# EAGLE design CartePrincipale (EAGLE 6.3)
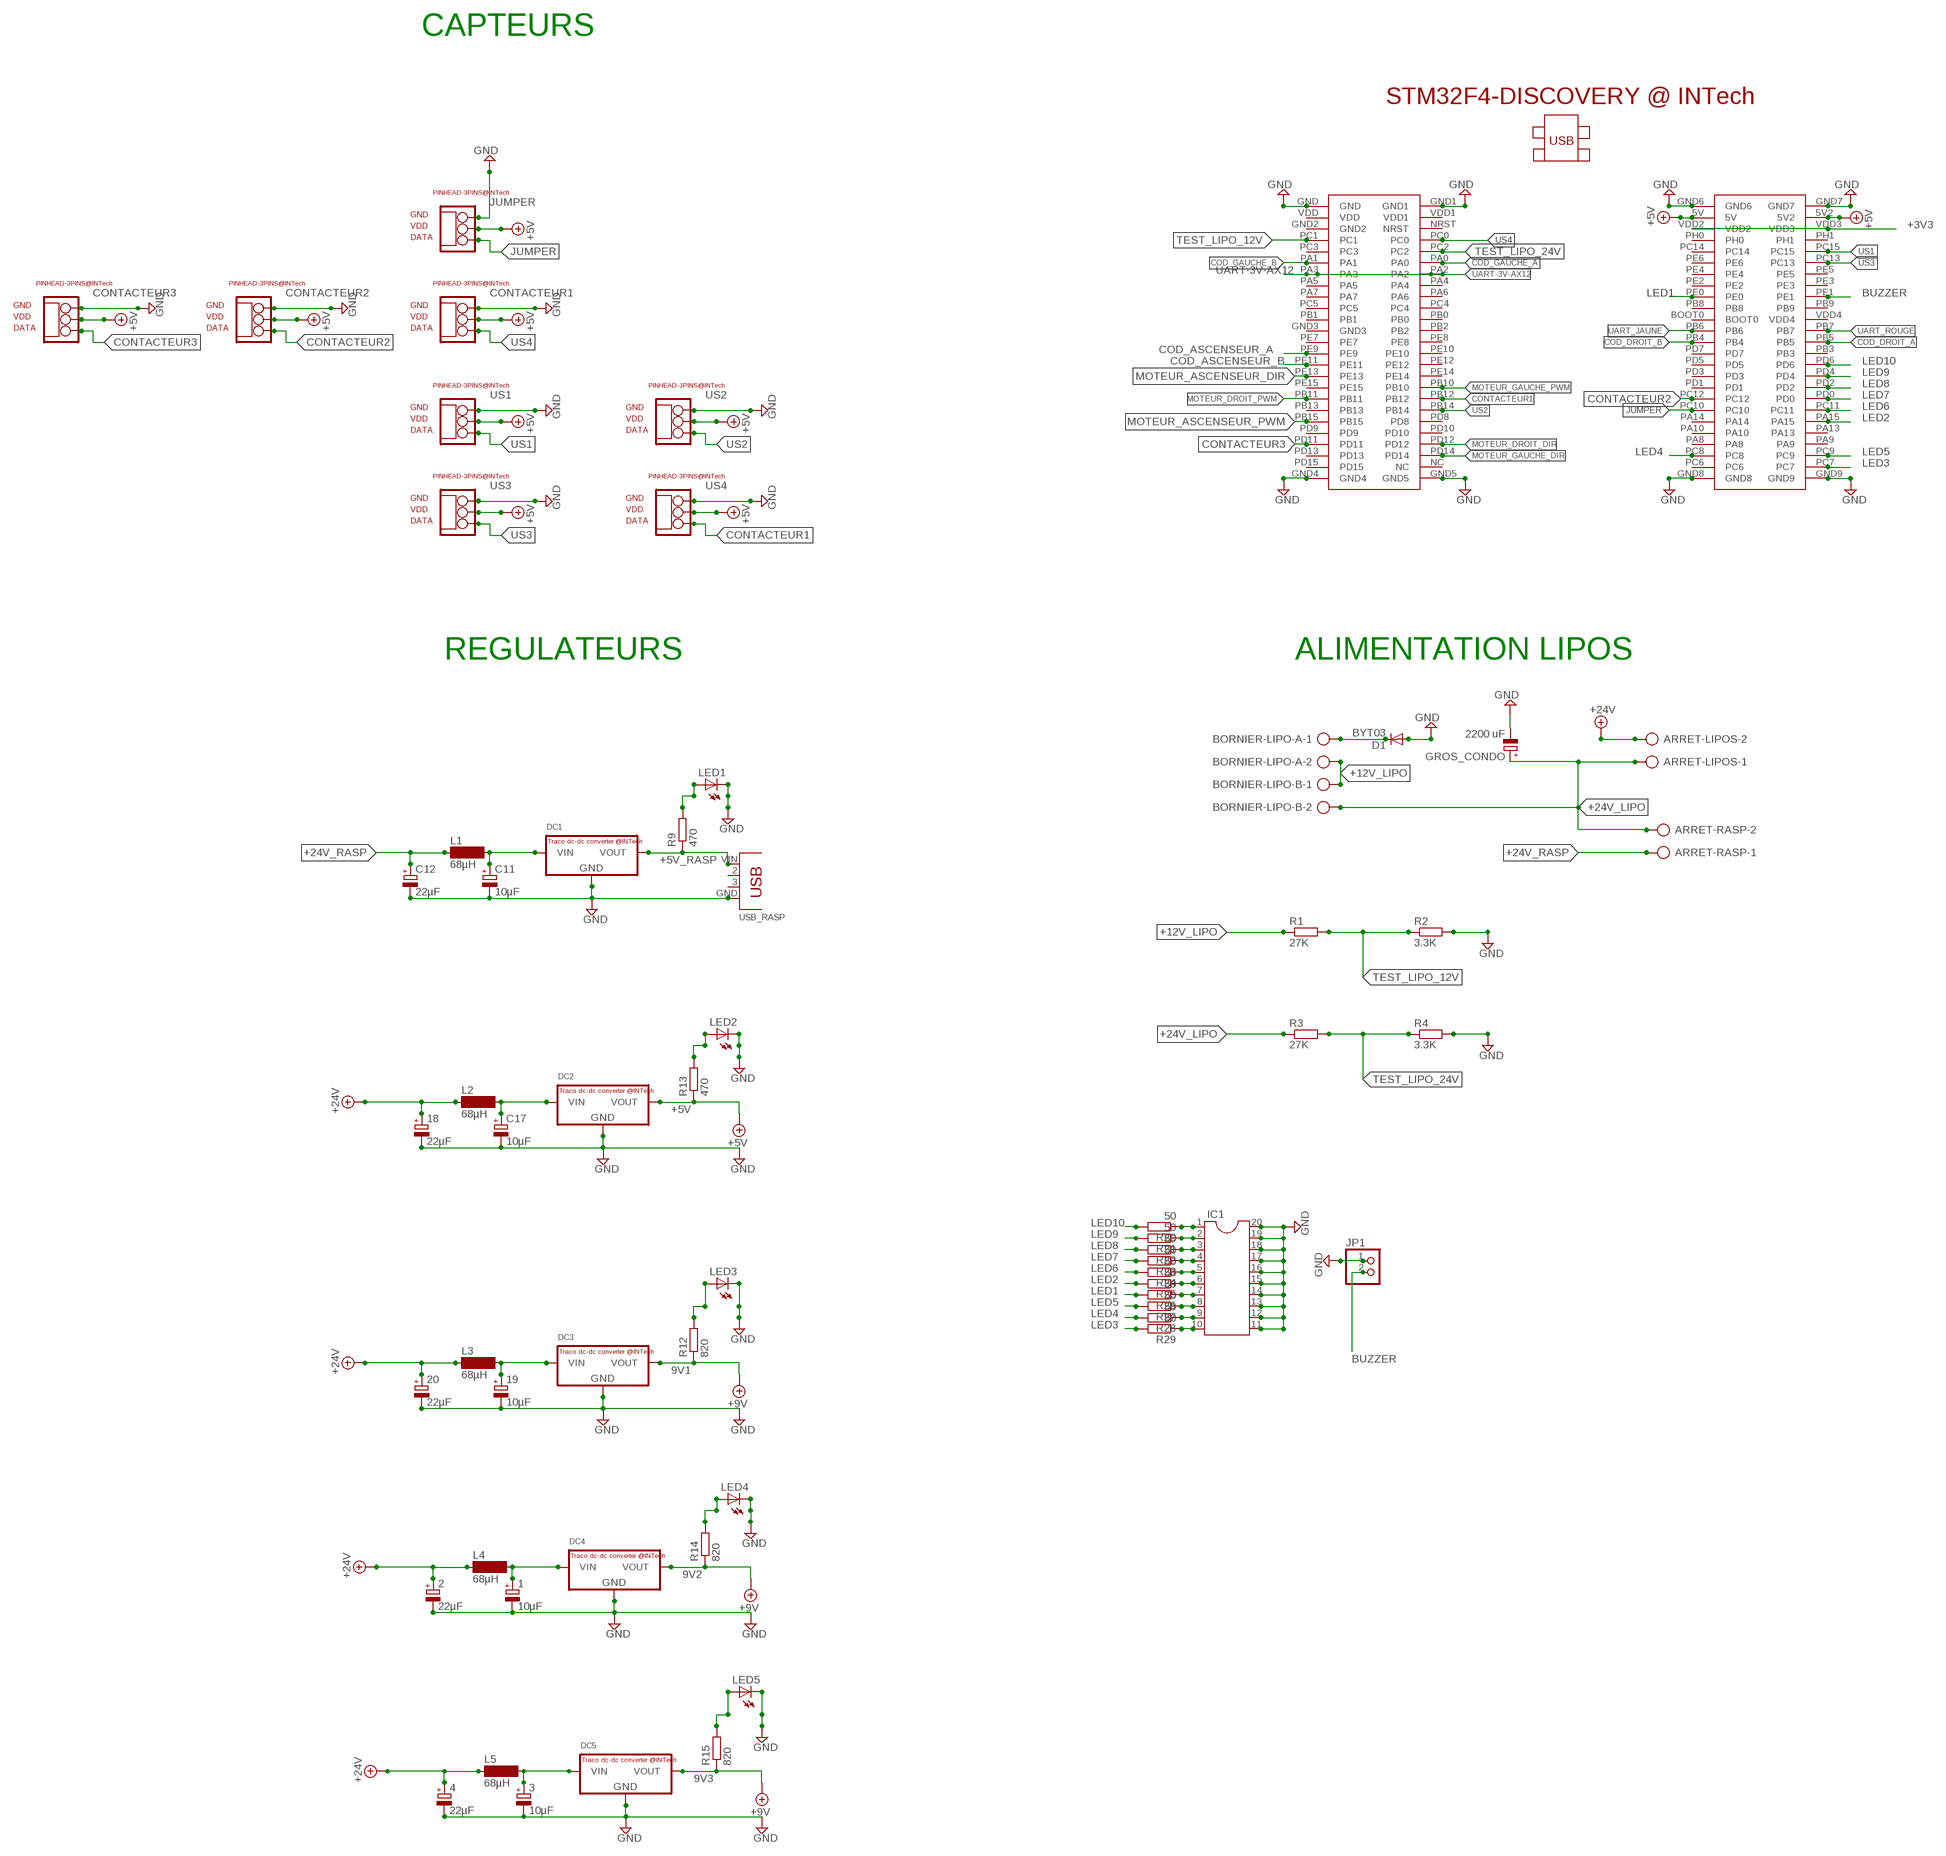
[diagram p0: schematic, sheet 1, part 1 of 2]
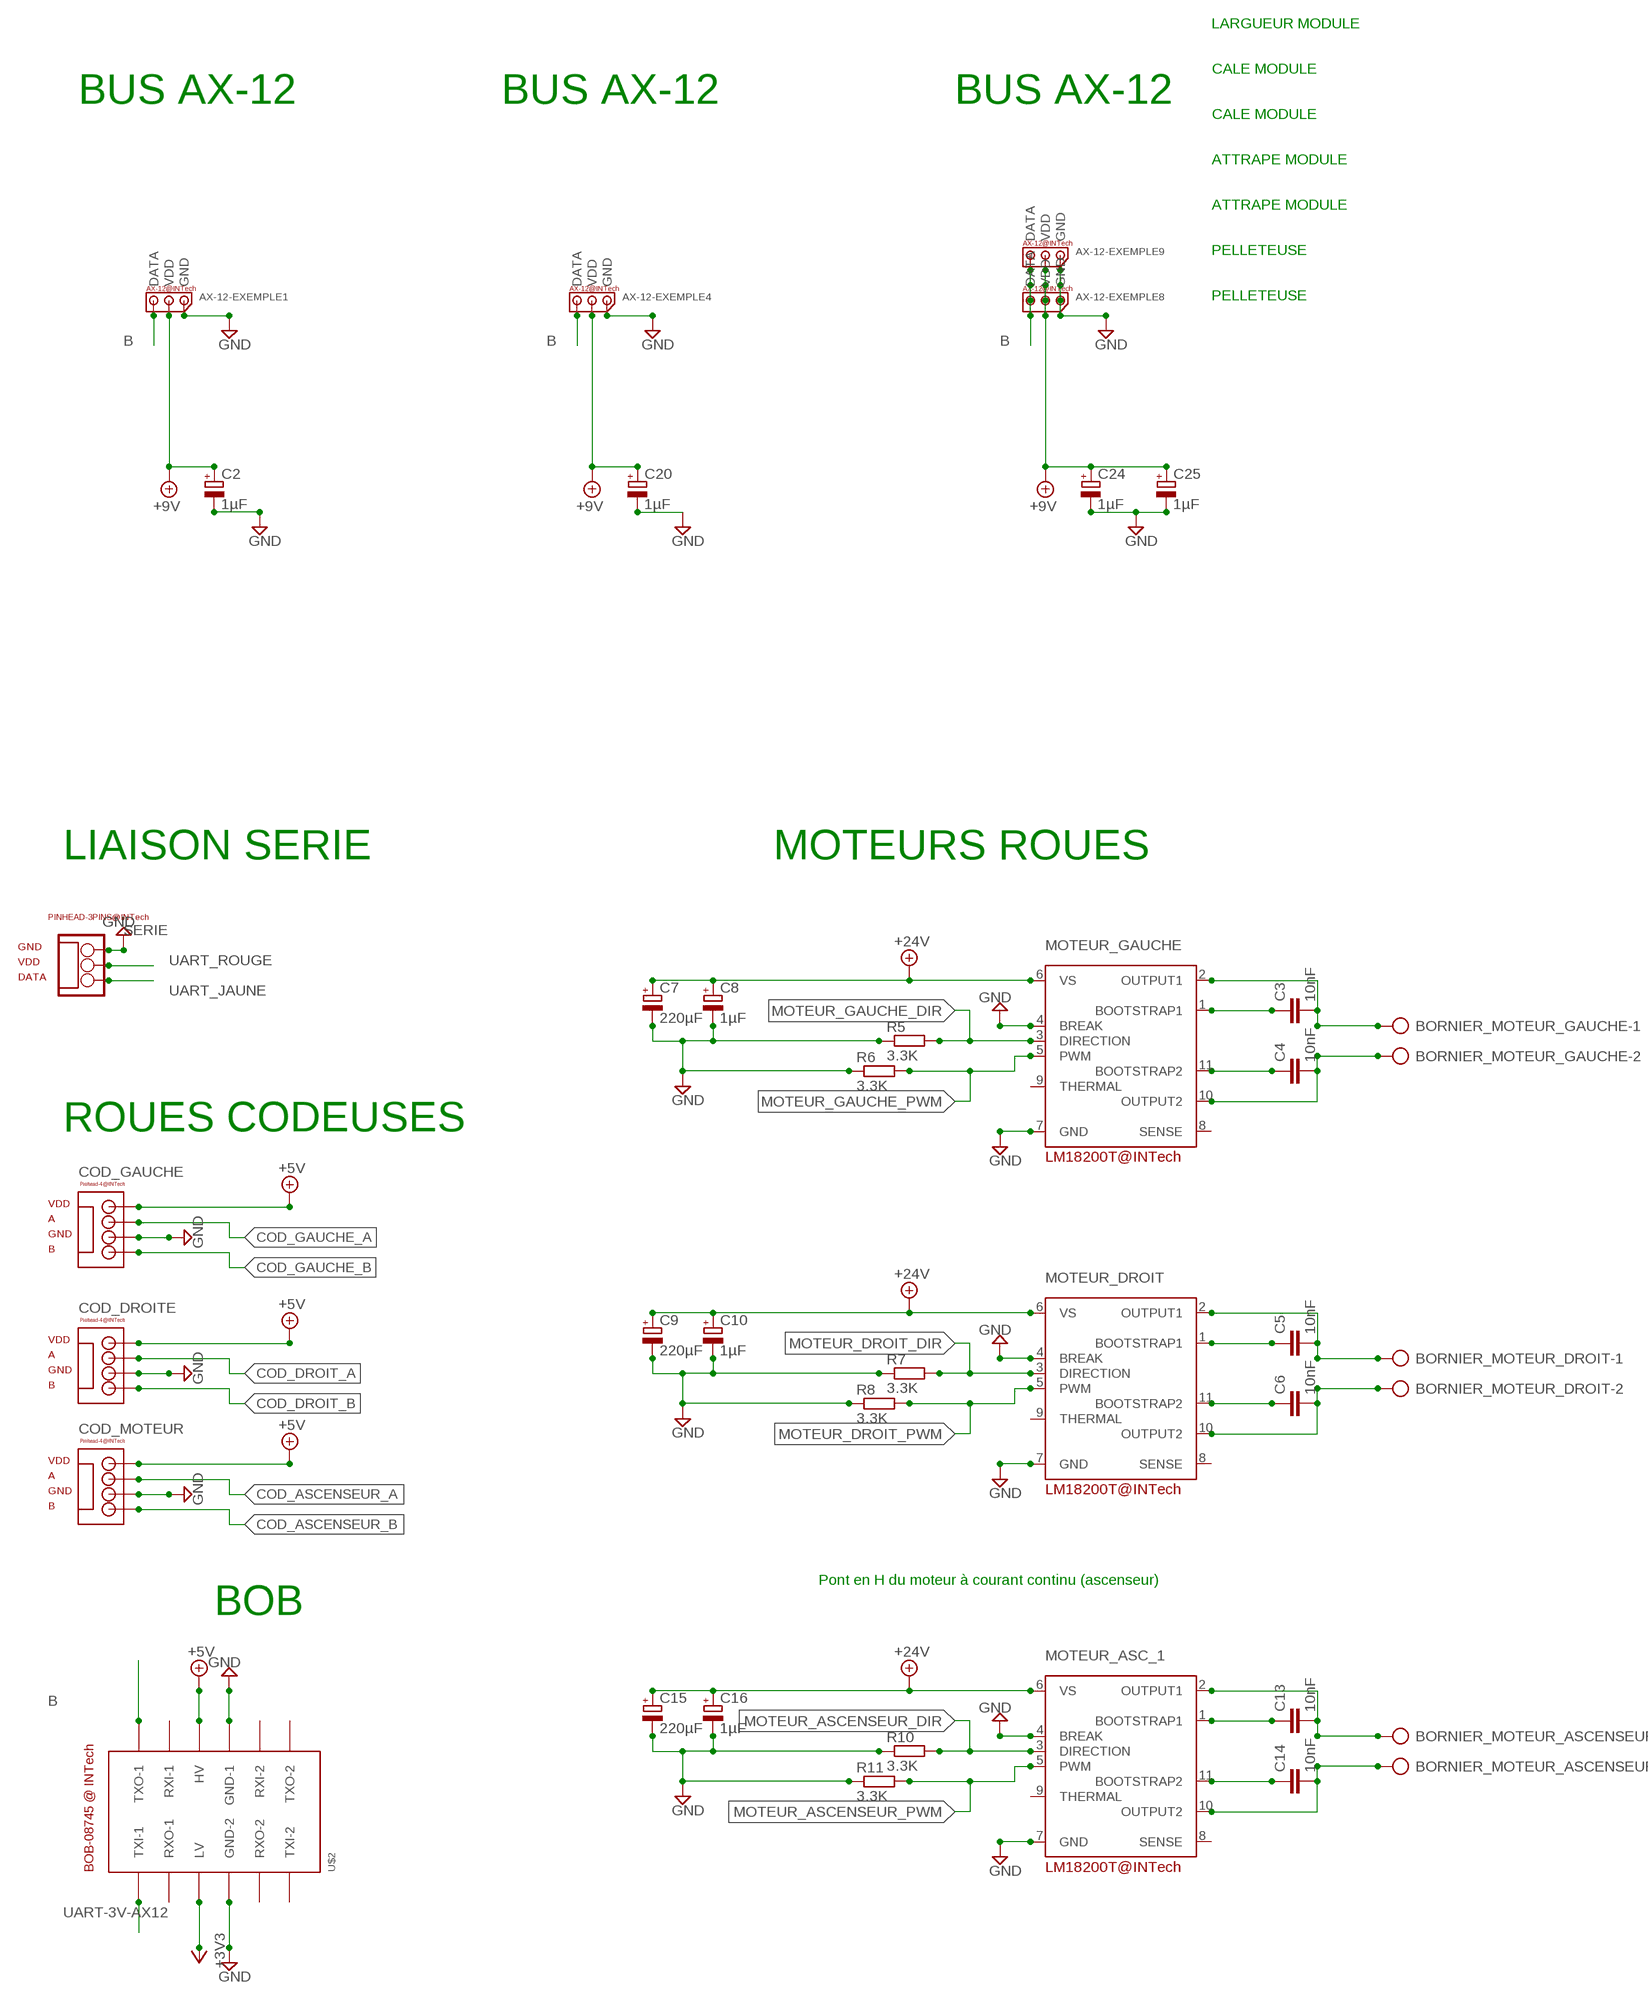
[diagram p1: schematic, sheet 1, part 2 of 2]

## Parts
1  10µF  CPOL-EUE2.5-6  [E2,5-6]
2  22µF  CPOL-EUE2.5-6  [E2,5-6]
3  10µF  CPOL-EUE2.5-6  [E2,5-6]
4  22µF  CPOL-EUE2.5-6  [E2,5-6]
18  22µF  CPOL-EUE2.5-6  [E2,5-6]
19  10µF  CPOL-EUE2.5-6  [E2,5-6]
20  22µF  CPOL-EUE2.5-6  [E2,5-6]
ARRET-LIPOS  AK300/2  [AK300/2]
ARRET-RASP  AK300/2  [AK300/2]
AX-12-EXEMPLE1  AX-12_CF_INTECH  [AX-12_CF_INTECH]
AX-12-EXEMPLE4  AX-12_CF_INTECH  [AX-12_CF_INTECH]
AX-12-EXEMPLE8  AX-12_CF_INTECH  [AX-12_CF_INTECH]
AX-12-EXEMPLE9  AX-12_CF_INTECH  [AX-12_CF_INTECH]
BORNIER-LIPO-A  AK300/2  [AK300/2]
BORNIER-LIPO-B  AK300/2  [AK300/2]
BORNIER_MOTEUR_ASCENSEUR  AK300/2  [AK300/2]
BORNIER_MOTEUR_DROIT  AK300/2  [AK300/2]
BORNIER_MOTEUR_GAUCHE  AK300/2  [AK300/2]
C2  1µF  CPOL-EUE2,5-6E  [E2,5-6E]
C3  10nF  C-EU050-025X075  [C050-025X075]
C4  10nF  C-EU050-025X075  [C050-025X075]
C5  10nF  C-EU050-025X075  [C050-025X075]
C6  10nF  C-EU050-025X075  [C050-025X075]
C7  220µF  CPOL-EUE3.5-8  [E3,5-8]
C8  1µF  CPOL-EUE3.5-8  [E3,5-8]
C9  220µF  CPOL-EUE3.5-8  [E3,5-8]
C10  1µF  CPOL-EUE3.5-8  [E3,5-8]
C11  10µF  CPOL-EUE2.5-6  [E2,5-6]
C12  22µF  CPOL-EUE2.5-6  [E2,5-6]
C13  10nF  C-EU050-025X075  [C050-025X075]
C14  10nF  C-EU050-025X075  [C050-025X075]
C15  220µF  CPOL-EUE3.5-8  [E3,5-8]
C16  1µF  CPOL-EUE3.5-8  [E3,5-8]
C17  10µF  CPOL-EUE2.5-6  [E2,5-6]
C20  1µF  CPOL-EUE2,5-6E  [E2,5-6E]
C24  1µF  CPOL-EUE2,5-6E  [E2,5-6E]
C25  1µF  CPOL-EUE2,5-6E  [E2,5-6E]
COD_DROITE  PINHEAD-4_CF_INTECH  [PINHEAD-4_CF_INTECH]
COD_GAUCHE  PINHEAD-4_CF_INTECH  [PINHEAD-4_CF_INTECH]
COD_MOTEUR  PINHEAD-4_CF_INTECH  [PINHEAD-4_CF_INTECH]
CONTACTEUR1  PINHEAD_CF_INTECH  [PINHEAD_CF_INTECH]
CONTACTEUR2  PINHEAD_CF_INTECH  [PINHEAD_CF_INTECH]
CONTACTEUR3  PINHEAD_CF_INTECH  [PINHEAD_CF_INTECH]
D1  BYT03  [DO27-15]
DC1  5V_1A  R-78C-1.0_INTECH  [SIP3_INTECH]
DC2  5V_1A  R-78C-1.0_INTECH  [SIP3_INTECH]
DC3  9V_1A  R-78C-1.0_INTECH  [SIP3_INTECH]
DC4  9V_1A  R-78C-1.0_INTECH  [SIP3_INTECH]
DC5  9V_1A  R-78C-1.0_INTECH  [SIP3_INTECH]
GROS_CONDO  2200 uF  CPOL-EUE10-20  [EB20D]
IC1  DIL20S  [SOCKET-20]
JP1  PINHD-1X2  [1X02]
JUMPER  PINHEAD_CF_INTECH  [PINHEAD_CF_INTECH]
L1  68µH  SD12K100  [SD12K100]
L2  68µH  SD12K100  [SD12K100]
L3  68µH  SD12K100  [SD12K100]
L4  68µH  SD12K100  [SD12K100]
L5  68µH  SD12K100  [SD12K100]
LED1  LED5MM  [LED5MM]
LED2  LED5MM  [LED5MM]
LED3  LED5MM  [LED5MM]
LED4  LED5MM  [LED5MM]
LED5  LED5MM  [LED5MM]
MOTEUR_ASC_1  LM18200T_CF_INTECH  [LM18200T_CF_INTECH]
MOTEUR_DROIT  LM18200T_CF_INTECH  [LM18200T_CF_INTECH]
MOTEUR_GAUCHE  LM18200T_CF_INTECH  [LM18200T_CF_INTECH]
R1  27K  R-EU_0207/10  [0207/10]
R2  3.3K  R-EU_0207/10  [0207/10]
R3  27K  R-EU_0207/10  [0207/10]
R4  3.3K  R-EU_0207/10  [0207/10]
R5  3.3K  R-EU_0207/10  [0207/10]
R6  3.3K  R-EU_0207/10  [0207/10]
R7  3.3K  R-EU_0207/10  [0207/10]
R8  3.3K  R-EU_0207/10  [0207/10]
R9  470  R-EU_0207/10  [0207/10]
R10  3.3K  R-EU_0207/10  [0207/10]
R11  3.3K  R-EU_0207/10  [0207/10]
R12  820  R-EU_0207/10  [0207/10]
R13  470  R-EU_0207/10  [0207/10]
R14  820  R-EU_0207/10  [0207/10]
R15  820  R-EU_0207/10  [0207/10]
R20  50  R-EU_0207/2V  [0207/2V]
R21  50  R-EU_0207/2V  [0207/2V]
R22  50  R-EU_0207/2V  [0207/2V]
R23  50  R-EU_0207/2V  [0207/2V]
R24  50  R-EU_0207/2V  [0207/2V]
R25  50  R-EU_0207/2V  [0207/2V]
R26  50  R-EU_0207/2V  [0207/2V]
R27  50  R-EU_0207/2V  [0207/2V]
R28  50  R-EU_0207/2V  [0207/2V]
R29  50  R-EU_0207/2V  [0207/2V]
SERIE  PINHEAD_CF_INTECH  [PINHEAD_CF_INTECH]
U$1  STM32F4-DISCOVERY  [STM32F4-DISCOVERY]
U$2  BOB-08745  [BOB-08745]
US1  PINHEAD_CF_INTECH  [PINHEAD_CF_INTECH]
US2  PINHEAD_CF_INTECH  [PINHEAD_CF_INTECH]
US3  PINHEAD_CF_INTECH  [PINHEAD_CF_INTECH]
US4  PINHEAD_CF_INTECH  [PINHEAD_CF_INTECH]
USB_RASP  USB_87520  [USB]

## Nets
9V1: AX-12-EXEMPLE8.VDD AX-12-EXEMPLE9.VDD C24.+ C25.+ DC3.VOUT R12.1 ; supply symbol labelled +9V
9V2: AX-12-EXEMPLE4.VDD C20.+ DC4.VOUT R14.1 ; supply symbol labelled +9V
9V3: AX-12-EXEMPLE1.VDD C2.+ DC5.VOUT R15.1 ; supply symbol labelled +9V
+3V3: U$1.VDD2 U$1.VDD3 U$2.LV
+5V: COD_DROITE.VDD COD_GAUCHE.VDD COD_MOTEUR.VDD CONTACTEUR1.VDD CONTACTEUR2.VDD CONTACTEUR3.VDD DC2.VOUT JUMPER.VDD R13.1 U$1.5V U$1.5V2 U$2.HV US1.VDD US2.VDD US3.VDD US4.VDD
+5V_RASP: DC1.VOUT R9.1 USB_RASP.VIN
+12V_LIPO: BORNIER-LIPO-A.2 BORNIER-LIPO-B.1 R1.1
+24V: 2.+ 4.+ 18.+ 20.+ ARRET-LIPOS.2 C7.+ C8.+ C9.+ C10.+ C15.+ C16.+ L2.1 L3.1 L4.1 L5.1 MOTEUR_ASC_1.6(VS) MOTEUR_DROIT.6(VS) MOTEUR_GAUCHE.6(VS)
+24V_LIPO: ARRET-LIPOS.1 ARRET-RASP.2 BORNIER-LIPO-B.2 GROS_CONDO.+ R3.1
+24V_RASP: ARRET-RASP.1 C12.+ L1.1
B: AX-12-EXEMPLE1.DATA AX-12-EXEMPLE4.DATA AX-12-EXEMPLE8.DATA AX-12-EXEMPLE9.DATA U$2.TXO-1
BUZZER: JP1.2 U$1.PE1
COD_ASCENSEUR_A: COD_MOTEUR.A U$1.PE9
COD_ASCENSEUR_B: COD_MOTEUR.B U$1.PE11
COD_DROIT_A: COD_DROITE.A U$1.PB5
COD_DROIT_B: COD_DROITE.B U$1.PB4
COD_GAUCHE_A: COD_GAUCHE.A U$1.PA0
COD_GAUCHE_B: COD_GAUCHE.B U$1.PA1
CONTACTEUR1: U$1.PB12 US4.DATA
CONTACTEUR2: CONTACTEUR2.DATA U$1.PC12
CONTACTEUR3: CONTACTEUR3.DATA U$1.PD11
GND: 1.- 2.- 3.- 4.- 18.- 19.- 20.- AX-12-EXEMPLE1.GND AX-12-EXEMPLE4.GND AX-12-EXEMPLE8.GND AX-12-EXEMPLE9.GND C2.- C7.- C8.- C9.- C10.- C11.- C12.- C15.- C16.- C17.- C20.- C24.- C25.- COD_DROITE.GND COD_GAUCHE.GND COD_MOTEUR.GND CONTACTEUR1.GND CONTACTEUR2.GND CONTACTEUR3.GND D1.A DC1.GND DC2.GND DC3.GND DC4.GND DC5.GND GROS_CONDO.- IC1.11 IC1.12 IC1.13 IC1.14 IC1.15 IC1.16 IC1.17 IC1.18 IC1.19 IC1.20 JP1.1 JUMPER.GND LED1.K(C) LED2.K(C) LED3.K(C) LED4.K(C) LED5.K(C) MOTEUR_ASC_1.4(BREAK) MOTEUR_ASC_1.7(GND) MOTEUR_DROIT.4(BREAK) MOTEUR_DROIT.7(GND) MOTEUR_GAUCHE.4(BREAK) MOTEUR_GAUCHE.7(GND) R2.2 R4.2 R5.1 R6.1 R7.1 R8.1 R10.1 R11.1 SERIE.GND U$1.GND U$1.GND1 U$1.GND4 U$1.GND5 U$1.GND6 U$1.GND7 U$1.GND8 U$1.GND9 U$2.GND-1 U$2.GND-2 US1.GND US2.GND US3.GND US4.GND USB_RASP.GND
JUMPER: JUMPER.DATA U$1.PC10
LED1: R26.2 U$1.PE0
LED2: R25.2 U$1.PA15
LED3: R29.2 U$1.PC7
LED4: R28.2 U$1.PC8
LED5: R27.2 U$1.PC9
LED6: R24.2 U$1.PC11
LED7: R23.2 U$1.PD0
LED8: R22.2 U$1.PD2
LED9: R21.2 U$1.PD4
LED10: R20.2 U$1.PD6
MOTEUR_ASCENSEUR_DIR: MOTEUR_ASC_1.3(DIRECTION) R10.2 U$1.PE13
MOTEUR_ASCENSEUR_PWM: MOTEUR_ASC_1.5(PWM) R11.2 U$1.PB15
MOTEUR_DROIT_DIR: MOTEUR_DROIT.3(DIRECTION) R7.2 U$1.PD12
MOTEUR_DROIT_PWM: MOTEUR_DROIT.5(PWM) R8.2 U$1.PB11
MOTEUR_GAUCHE_DIR: MOTEUR_GAUCHE.3(DIRECTION) R5.2 U$1.PD14
MOTEUR_GAUCHE_PWM: MOTEUR_GAUCHE.5(PWM) R6.2 U$1.PB10
N$1: BORNIER-LIPO-A.1 D1.C
N$2: C4.1 MOTEUR_GAUCHE.11(BOOTSTRAP2)
N$3: C3.1 MOTEUR_GAUCHE.1(BOOTSTRAP1)
N$4: C13.1 MOTEUR_ASC_1.1(BOOTSTRAP1)
N$5: C14.1 MOTEUR_ASC_1.11(BOOTSTRAP2)
N$6: BORNIER_MOTEUR_ASCENSEUR.1 C13.2 MOTEUR_ASC_1.2(OUTPUT1)
N$7: BORNIER_MOTEUR_ASCENSEUR.2 C14.2 MOTEUR_ASC_1.10(OUTPUT2)
N$8: 1.+ DC4.VIN L4.2
N$9: LED1.A R9.2
N$10: C5.1 MOTEUR_DROIT.1(BOOTSTRAP1)
N$11: C6.1 MOTEUR_DROIT.11(BOOTSTRAP2)
N$12: C11.+ DC1.VIN L1.2
N$15: C17.+ DC2.VIN L2.2
N$18: BORNIER_MOTEUR_GAUCHE.1 C3.2 MOTEUR_GAUCHE.2(OUTPUT1)
N$19: BORNIER_MOTEUR_GAUCHE.2 C4.2 MOTEUR_GAUCHE.10(OUTPUT2)
N$20: BORNIER_MOTEUR_DROIT.1 C5.2 MOTEUR_DROIT.2(OUTPUT1)
N$21: BORNIER_MOTEUR_DROIT.2 C6.2 MOTEUR_DROIT.10(OUTPUT2)
N$22: 19.+ DC3.VIN L3.2
N$24: 3.+ DC5.VIN L5.2
N$26: IC1.1 R20.1
N$27: IC1.2 R21.1
N$28: IC1.3 R22.1
N$29: IC1.4 R23.1
N$30: IC1.5 R24.1
N$31: IC1.6 R25.1
N$32: IC1.7 R26.1
N$33: IC1.8 R27.1
N$34: IC1.9 R28.1
N$35: IC1.10 R29.1
N$36: LED2.A R13.2
N$38: LED3.A R12.2
N$40: LED5.A R15.2
N$42: LED4.A R14.2
TEST_LIPO_12V: R1.2 R2.1 U$1.PC1
TEST_LIPO_24V: R3.2 R4.1 U$1.PC2
UART-3V-AX12: U$1.PA2 U$1.PA3 U$2.TXI-1
UART_JAUNE: SERIE.DATA U$1.PB6
UART_ROUGE: SERIE.VDD U$1.PB7
US1: U$1.PC15 US1.DATA
US2: U$1.PB14 US2.DATA
US3: U$1.PC13 US3.DATA
US4: CONTACTEUR1.DATA U$1.PC0
Unconnected: MOTEUR_ASC_1.8(SENSE) MOTEUR_ASC_1.9(THERMAL) MOTEUR_DROIT.8(SENSE) MOTEUR_DROIT.9(THERMAL) MOTEUR_GAUCHE.8(SENSE) MOTEUR_GAUCHE.9(THERMAL) U$1.BOOT0 U$1.GND2 U$1.GND3 U$1.NC U$1.NRST U$1.PA4 U$1.PA5 U$1.PA6 U$1.PA7 U$1.PA8 U$1.PA9 U$1.PA10 U$1.PA13 U$1.PA14 U$1.PB0 U$1.PB1 U$1.PB2 U$1.PB3 U$1.PB8 U$1.PB9 U$1.PB13 U$1.PC3 U$1.PC4 U$1.PC5 U$1.PC6 U$1.PC14 U$1.PD1 U$1.PD3 U$1.PD5 U$1.PD7 U$1.PD8 U$1.PD9 U$1.PD10 U$1.PD13 U$1.PD15 U$1.PE2 U$1.PE3 U$1.PE4 U$1.PE5 U$1.PE6 U$1.PE7 U$1.PE8 U$1.PE10 U$1.PE12 U$1.PE14 U$1.PE15 U$1.PH0 U$1.PH1 U$1.VDD U$1.VDD1 U$1.VDD4 U$2.RXI-1 U$2.RXI-2 U$2.RXO-1 U$2.RXO-2 U$2.TXI-2 U$2.TXO-2 USB_RASP.2 USB_RASP.3

## Notes on the sheet
- CAPTEURS | LARGUEUR MODULE
- CALE MODULE
- BUS AX-12 | BUS AX-12 | BUS AX-12
- CALE MODULE
- ATTRAPE MODULE
- ATTRAPE MODULE
- PELLETEUSE
- PELLETEUSE
- REGULATEURS | ALIMENTATION LIPOS | LIAISON SERIE | MOTEURS ROUES
- ROUES CODEUSES
- Pont en H du moteur à courant continu (ascenseur)
- BOB

## Library data of the parts
1-4 18-20 C2 C7-C12 C15-C17 C20 C24 C25 GROS_CONDO = resistor:CPOL-EU: POLARIZED CAPACITOR, European symbol
ARRET-LIPOS ARRET-RASP BORNIER-LIPO-A BORNIER-LIPO-B BORNIER_MOTEUR_ASCENSEUR BORNIER_MOTEUR_DROIT BORNIER_MOTEUR_GAUCHE = con-ptr500:AK300/2: CONNECTOR; OC_FARNELL: unknown; OC_NEWARK: unknown
AX-12-EXEMPLE1 AX-12-EXEMPLE4 AX-12-EXEMPLE8 AX-12-EXEMPLE9 = INTech:AX-12_CF_INTECH: Connecteur wire-to-board 3 points pour servo-moteurs Dynamixel AX-12
C3-C6 C13 C14 = resistor:C-EU: CAPACITOR, European symbol
COD_DROITE COD_GAUCHE COD_MOTEUR = INTech:PINHEAD-4_CF_INTECH: Connecteurs wire-to-board 4 pins (codeuses)
CONTACTEUR1-CONTACTEUR3 JUMPER SERIE US1-US4 = pinhead_CF_INTech:PINHEAD_CF_INTECH: Connecteur 3 pins (ultrasons, série...)
D1 = diode:BYT03: DIODE ultra fast
DC1-DC5 = INTech:R-78C*-1.0_INTECH: Convertisseur dc-dc Traco
IC1 = ic-package:DIL20: Dual In Line / Socket
JP1 = pinhead:PINHD-1X2: PIN HEADER
L1-L5 = inductor-neosid:SD12: INDUCTOR nominal inductance; OC_FARNELL: unknown; OC_NEWARK: unknown
LED1-LED5 = led:LED: LED OSRAM: - CHIPLED LG R971, LG N971, LY N971, LG Q971, LY Q971, LO R971, LY R971 LH N974, LH R974 LS Q976, LO Q976, LY Q976 LO Q996 - Hyper CHIPLED LW Q18S LB Q993, LB Q99A, LB R99A - SideLED LS A670, LO A670, LY A670, LG A670, LP A670 LB A673, LV A673, LT A673, LW A673 LH A674 LY A675 LS A676, LA A676, LO A676, LY A676, LW A676 LS A679, LY A679, LG A679 - Hyper Micro SIDELED® LS Y876, LA Y876, LO Y876, LY Y876 LT Y87S - SmartLED LW L88C, LW L88S LB L89C, LB L89S, LG L890 LS L89K, LO L89K, LY L89K LS L896, LA L896, LO L896, LY L896 - TOPLED LS T670, LO T670, LY T670, LG T670, LP T670 LSG T670, LSP T670, LSY T670, LOP T670, LYG T670 LG T671, LOG T671, LSG T671 LB T673, LV T673, LT T673, LW T673 LH T674 LS T676, LA T676, LO T676, LY T676, LB T676, LH T676, LSB T676, LW T676 LB T67C, LV T67C, LT T67C, LS T67K, LO T67K, LY T67K, LW E67C LS E67B, LA E67B, LO E67B, LY E67B, LB E67C, LV E67C, LT E67C LW T67C LS T679, LY T679, LG T679 LS T770, LO T770, LY T770, LG T770, LP T770 LB T773, LV T773, LT T773, LW T773 LH T774 LS E675, LA E675, LY E675, LS T675 LS T776, LA T776, LO T776, LY T776, LB T776 LHGB T686 LT T68C, LB T68C - Hyper Mini TOPLED® LB M676 - Mini TOPLED Santana® LG M470 LS M47K, LO M47K, LY M47K Source: http://www.osram.convergy.de LUXEON: - LUMILED® LXK2-PW12-R00, LXK2-PW12-S00, LXK2-PW14-U00, LXK2-PW14-V00 LXK2-PM12-R00, LXK2-PM12-S00, LXK2-PM14-U00 LXK2-PE12-Q00, LXK2-PE12-R00, LXK2-PE12-S00, LXK2-PE14-T00, LXK2-PE14-U00 LXK2-PB12-K00, LXK2-PB12-L00, LXK2-PB12-M00, LXK2-PB14-N00, LXK2-PB14-P00, LXK2-PB14-Q00 LXK2-PR12-L00, LXK2-PR12-M00, LXK2-PR14-Q00, LXK2-PR14-R00 LXK2-PD12-Q00, LXK2-PD12-R00, LXK2-PD12-S00 LXK2-PH12-R00, LXK2-PH12-S00 LXK2-PL12-P00, LXK2-PL12-Q00, LXK2-PL12-R00 Source: www.luxeon.com KINGBRIGHT: KA-3528ASYC Source: www.kingbright.com
MOTEUR_ASC_1 MOTEUR_DROIT MOTEUR_GAUCHE = LM18200T_CF_INTech:LM18200T_CF_INTECH: Pont en H pour le contrôle de moteurs
R1-R15 R20-R29 = resistor:R-EU_: RESISTOR, European symbol
U$1 = STM32F4-DISCOVERY_CF_INTECH:STM32F4-DISCOVERY
U$2 = INTech:BOB-08745: Convertisseur de niveau logique BOB-08745
USB_RASP = USB_CF_INTech:USB_87520: Connecteur pour alimentation USB-85720 (Raspberry...)

## Board
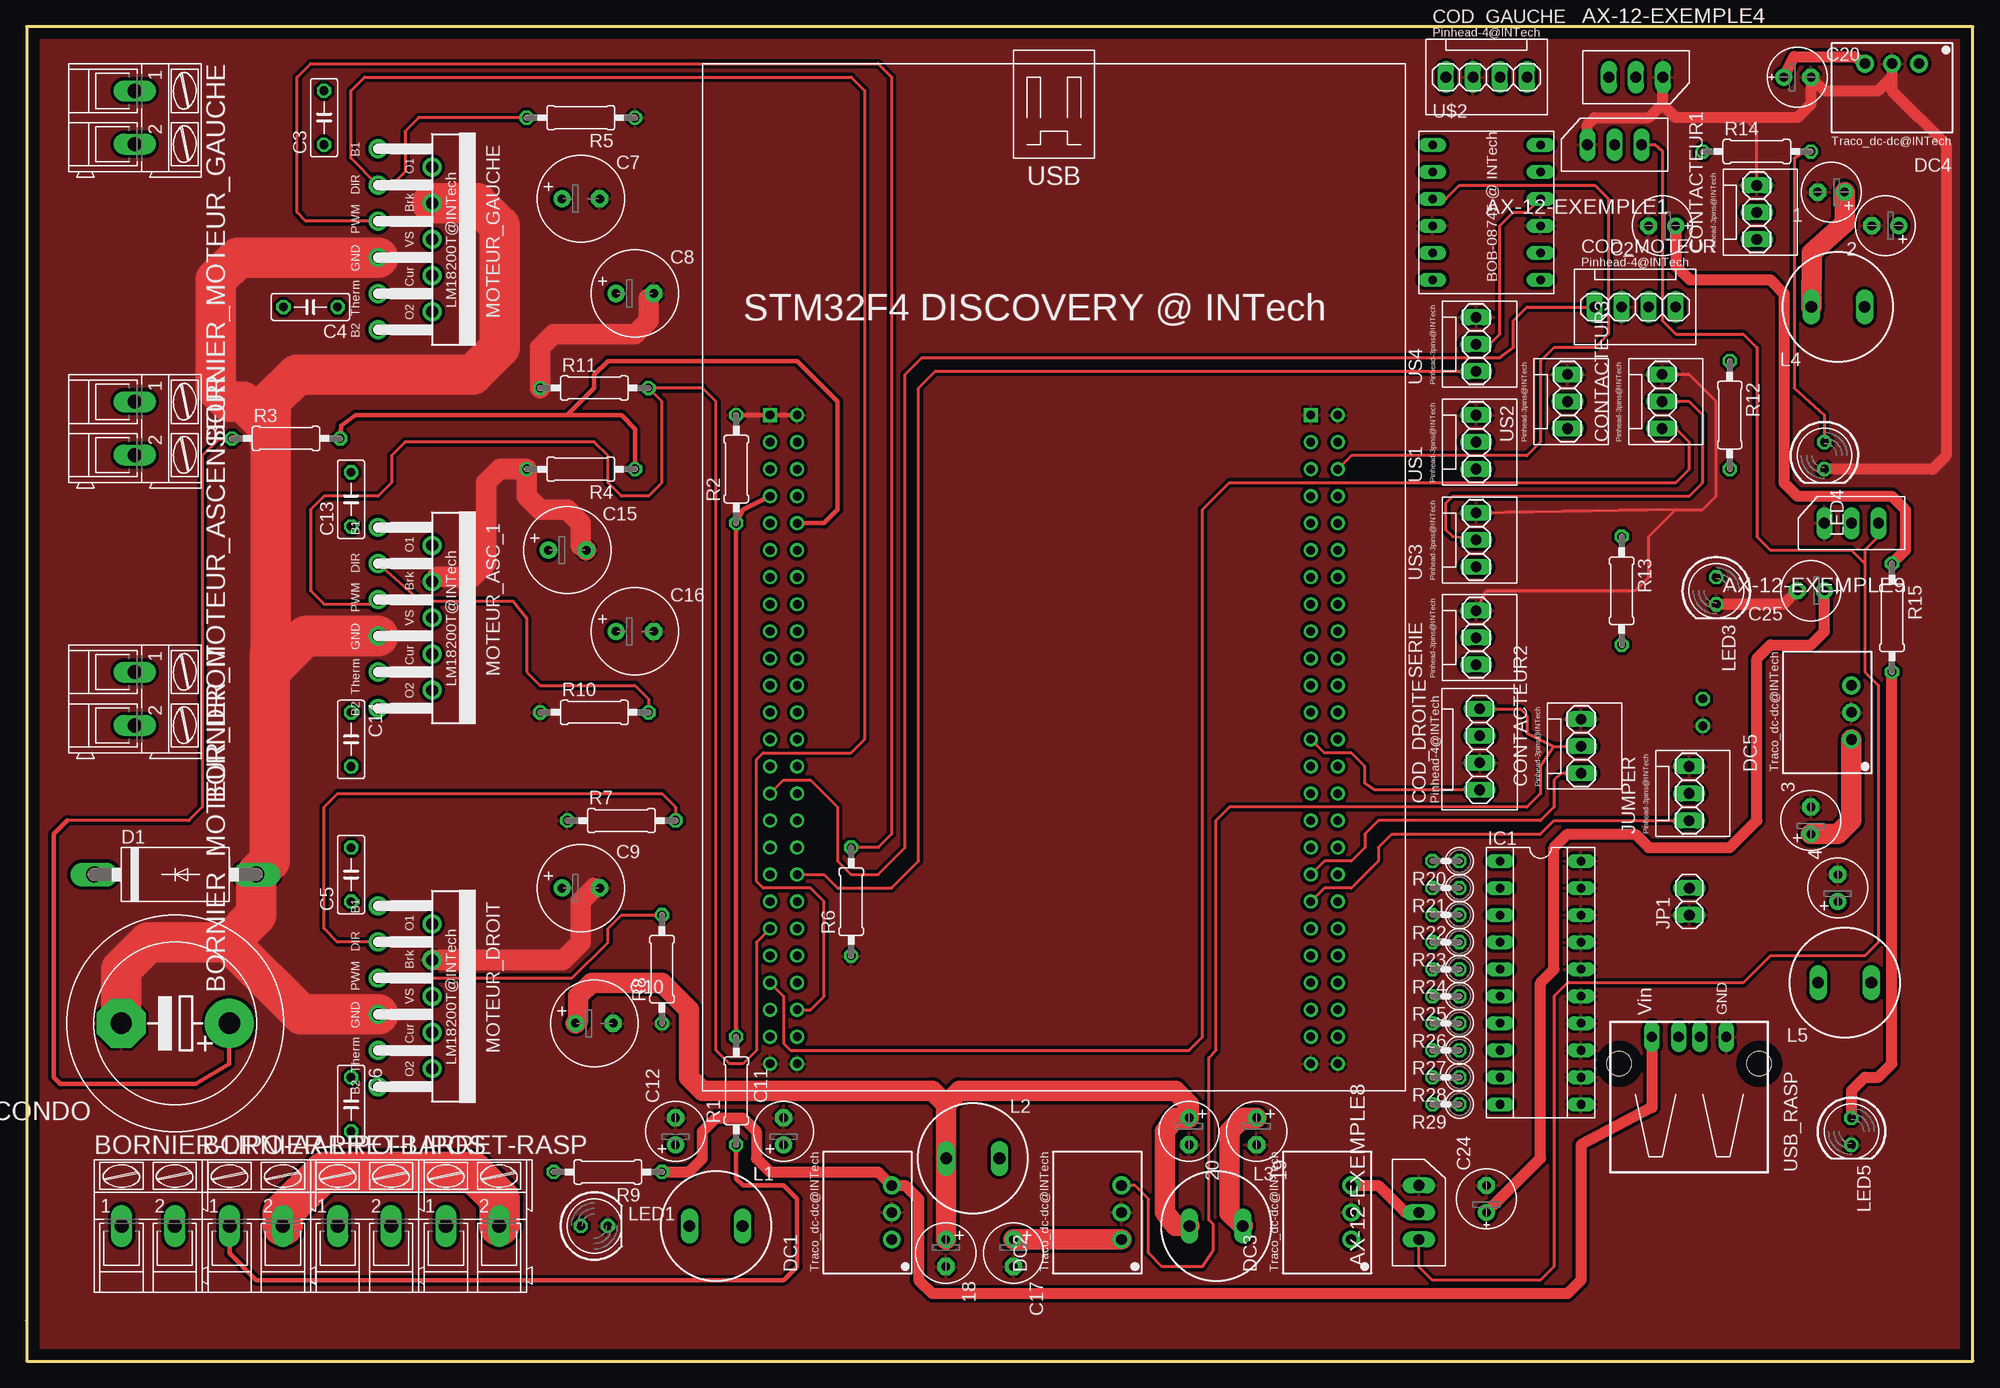
[diagram p2: board, top side]
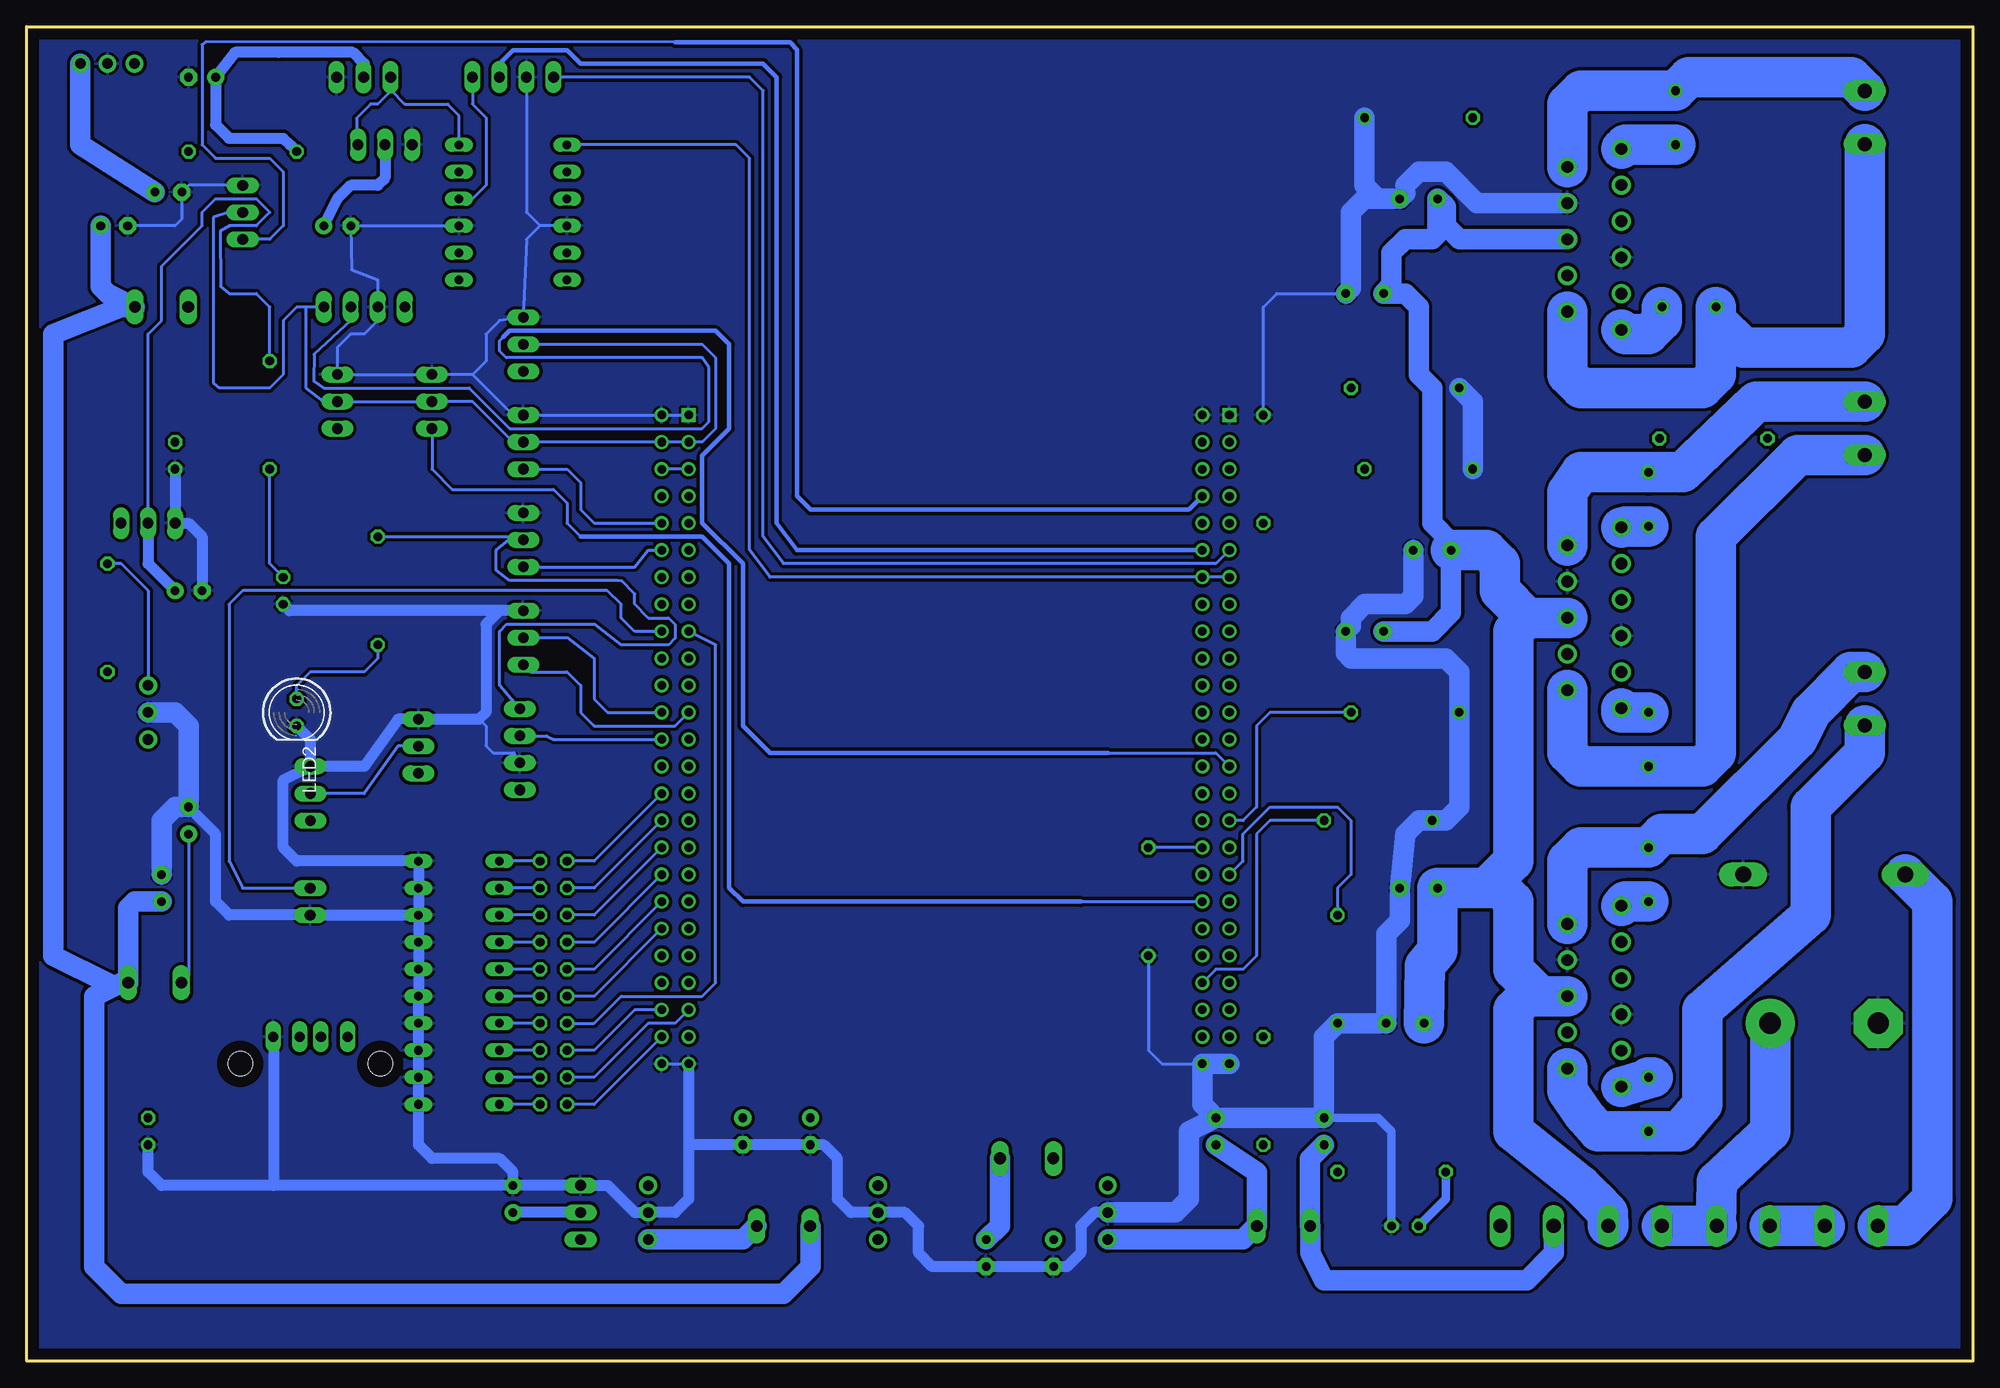
[diagram p3: board, bottom side, seen from below]

Size 182.86 x 125.4 mm. Coordinates in mm from the lower left corner, seen from the top.
Outline: 0,0 182.86,0 182.86,125.4 0,125.4 0,0
Copper layers (1*16): Top 0.035mm / dielectric 1.5mm / Bottom 0.035mm
Design rules "default *": minimum track width 12mil, minimum drill 24mil, track to track 12mil, track to pad 12mil, pad to pad 12mil, via to via 12mil, smd to smd 12mil, copper to edge 40mil, drill to drill 12mil, minimum pad ring 10mil, minimum via ring 8mil, stop-mask expansion 4mil, vias tented up to drill 0mil, thermal gap 10mil

### Footprints (pad centres in the part's own frame; a part is rotated, then mirrored left to right if it is on the bottom)
E2,5-6 = drill 0.813 pad 1.6: + -1.27,0 | drill 0.813 pad 1.6 octagon: - 1.27,0
AK300/2 = drill 1.321 long: 1 -2.515,0; 2 2.489,0
AX-12_CF_INTECH = drill 1.016 long: DATA -2.54,0; GND 2.54,0; VDD 0,0
E2,5-6E = drill 0.813 pad 1.575: + -1.27,0 | drill 0.813 pad 1.575 octagon: - 1.27,0
C050-025X075 = drill 0.813 octagon: 1 -2.54,0; 2 2.54,0
E3,5-8 = drill 0.813 pad 1.6: + -1.778,0 | drill 0.813 pad 1.6 octagon: - 1.778,0
PINHEAD-4_CF_INTECH = drill 1 long: A 1.27,0; B -3.81,0; GND -1.27,0; VDD 3.81,0
PINHEAD_CF_INTECH = drill 1 long: DATA -2.54,0; GND 2.54,0; VDD 0,0
DO27-15 = drill 1.499 long: A 7.62,0; C -7.62,0
SIP3_INTECH = drill 1 pad 1.676: GND 0,0; VIN -2.54,0; VOUT 2.54,0
EB20D = drill 2.007 pad 4.597: + -5.08,0 | drill 2.007 pad 4.597 octagon: - 5.08,0
SOCKET-20 = drill 0.813 long: 1 -11.43,-3.81; 2 -8.89,-3.81; 3 -6.35,-3.81; 4 -3.81,-3.81; 5 -1.27,-3.81; 6 1.27,-3.81; 7 3.81,-3.81; 8 6.35,-3.81; 9 8.89,-3.81; 10 11.43,-3.81; 11 11.43,3.81; 12 8.89,3.81; 13 6.35,3.81; 14 3.81,3.81; 15 1.27,3.81; 16 -1.27,3.81; 17 -3.81,3.81; 18 -6.35,3.81; 19 -8.89,3.81; 20 -11.43,3.81
1X02 = drill 1.016 long: 1 -1.27,0; 2 1.27,0
SD12K100 = drill 1.1 long: 1 -2.5,0; 2 2.5,0
LED5MM = drill 0.813 octagon: A -1.27,0; K 1.27,0
LM18200T_CF_INTECH = drill 1.1 pad 1.778: 1 -8.5,-8.89; 2 -6.8,-3.81; 3 -5.1,-8.89; 4 -3.4,-3.81; 5 -1.7,-8.89; 6 0,-3.81; 7 1.7,-8.89; 8 3.4,-3.81; 9 5.1,-8.89; 10 6.8,-3.81; 11 8.5,-8.89
0207/10 = drill 0.813 octagon: 1 -5.08,0; 2 5.08,0
0207/2V = drill 0.813 octagon: 1 -1.27,0; 2 1.27,0
STM32F4-DISCOVERY = drill 0.8: 5V 24.13,12.7; 5V2 26.67,12.7; BOOT0 24.13,-10.16; GND1 -24.13,15.24; GND2 -26.67,10.16; GND3 -26.67,-12.7; GND4 -26.67,-45.72; GND5 -24.13,-45.72; GND7 26.67,15.24; GND8 24.13,-45.72; GND9 26.67,-45.72; NC -24.13,-43.18; NRST -24.13,10.16; PA0 -24.13,2.54; PA1 -26.67,2.54; PA2 -24.13,0; PA3 -26.67,0; PA4 -24.13,-2.54; PA5 -26.67,-2.54; PA6 -24.13,-5.08; PA7 -26.67,-5.08; PA8 24.13,-38.1; PA9 26.67,-38.1; PA10 24.13,-35.56; PA13 26.67,-35.56; PA14 24.13,-33.02; PA15 26.67,-33.02; PB0 -24.13,-10.16; PB1 -26.67,-10.16; PB2 -24.13,-12.7; PB3 26.67,-17.78; PB4 24.13,-15.24; PB5 26.67,-15.24; PB6 24.13,-12.7; PB7 26.67,-12.7; PB8 24.13,-7.62; PB9 26.67,-7.62; PB10 -24.13,-25.4; PB11 -26.67,-27.94; PB12 -24.13,-27.94; PB13 -26.67,-30.48; PB14 -24.13,-30.48; PB15 -26.67,-33.02; PC0 -24.13,7.62; PC1 -26.67,7.62; PC2 -24.13,5.08; PC3 -26.67,5.08; PC4 -24.13,-7.62; PC5 -26.67,-7.62; PC6 24.13,-43.18; PC7 26.67,-43.18; PC8 24.13,-40.64; PC9 26.67,-40.64; PC10 24.13,-30.48; PC11 26.67,-30.48; PC12 24.13,-27.94; PC13 26.67,2.54; PC14 24.13,5.08; PC15 26.67,5.08; PD0 26.67,-27.94; PD1 24.13,-25.4; PD2 26.67,-25.4; PD3 24.13,-22.86; PD4 26.67,-22.86; PD5 24.13,-20.32; PD6 26.67,-20.32; PD7 24.13,-17.78; PD8 -24.13,-33.02; PD9 -26.67,-35.56; PD10 -24.13,-35.56; PD11 -26.67,-38.1; PD12 -24.13,-38.1; PD13 -26.67,-40.64; PD14 -24.13,-40.64; PD15 -26.67,-43.18; PE0 24.13,-5.08; PE1 26.67,-5.08; PE2 24.13,-2.54; PE3 26.67,-2.54; PE4 24.13,0; PE5 26.67,0; PE6 24.13,2.54; PE7 -26.67,-15.24; PE8 -24.13,-15.24; PE9 -26.67,-17.78; PE10 -24.13,-17.78; PE11 -26.67,-20.32; PE12 -24.13,-20.32; PE13 -26.67,-22.86; PE14 -24.13,-22.86; PE15 -26.67,-25.4; PH0 24.13,7.62; PH1 26.67,7.62; VDD -26.67,12.7; VDD1 -24.13,12.7; VDD2 24.13,10.16; VDD3 26.67,10.16; VDD4 26.67,-10.16 | drill 0.8 square: GND -26.67,15.24; GND6 24.13,15.24
BOB-08745 = drill 0.8 long: GND-1 1.27,5.08; GND-2 1.27,-5.08; HV -1.27,5.08; LV -1.27,-5.08; RXI-1 -3.81,5.08; RXI-2 3.81,5.08; RXO-1 -3.81,-5.08; RXO-2 3.81,-5.08; TXI-1 -6.35,-5.08; TXI-2 6.35,-5.08; TXO-1 -6.35,5.08; TXO-2 6.35,5.08
USB = drill 0.95 long: 2 -1,2.54; 3 1,2.54; GND 3.5,2.54; VIN -3.5,2.54 | hole 2.3: -6.57,0; 6.57,0

### Placement (x,y rotation side)
1  169.55,109.86 180 top
2  174.62,106.68 180 top
3  167.64,50.8 90 top
4  170.18,44.45 90 top
18  86.36,10.16 270 top
19  115.57,21.59 270 top
20  109.22,21.59 270 top
ARRET-LIPOS  31.75,12.7 0 top
ARRET-RASP  41.91,12.7 0 top
AX-12-EXEMPLE1  149.19,114.3 180 top
AX-12-EXEMPLE4  151.2,120.65 0 top
AX-12-EXEMPLE8  130.81,13.97 90 top
AX-12-EXEMPLE9  171.45,78.74 180 top
BORNIER-LIPO-A  11.43,12.7 0 top
BORNIER-LIPO-B  21.59,12.7 0 top
BORNIER_MOTEUR_ASCENSEUR  10.16,87.63 270 top
BORNIER_MOTEUR_DROIT  10.16,62.23 270 top
BORNIER_MOTEUR_GAUCHE  10.16,116.84 270 top
C2  153.67,106.68 180 top
C3  27.94,116.84 90 top
C4  26.67,99.06 180 top
C5  30.48,45.72 90 top
C6  30.48,24.13 270 top
C7  52.07,109.22 0 top
C8  57.15,100.33 0 top
C9  52.07,44.45 0 top
C10  53.34,31.75 0 top
C11  71.12,21.59 90 top
C12  60.96,21.59 90 top
C13  30.48,80.98 90 top
C14  30.48,58.42 270 top
C15  50.8,76.2 0 top
C16  57.15,68.58 0 top
C17  92.71,10.16 270 top
C20  166.37,120.65 0 top
C24  137.16,15.24 90 top
C25  167.64,72.39 180 top
COD_DROITE  136.52,57.48 90 top
COD_GAUCHE  137.16,120.65 0 top
COD_MOTEUR  151.13,99.06 0 top
CONTACTEUR1  162.56,107.95 90 top
CONTACTEUR2  146.05,57.79 90 top
CONTACTEUR3  153.67,90.17 90 top
D1  13.97,45.72 0 top
DC1  81.28,13.97 90 top
DC2  102.87,13.97 90 top
DC3  124.46,13.97 90 top
DC4  175.26,121.92 180 top
DC5  171.45,60.96 90 top
GROS_CONDO  13.97,31.75 180 top
IC1  142.24,35.56 270 top
JP1  156.21,43.18 90 top
JUMPER  156.21,53.34 90 top
L1  64.77,12.7 0 top
L2  88.9,19.05 0 top
L3  111.76,12.7 0 top
L4  170.18,99.06 180 top
L5  170.81,35.56 180 top
LED1  53.34,12.7 0 top
LED2  157.48,60.96 270 bottom
LED3  158.75,72.39 270 top
LED4  168.91,85.09 270 top
LED5  171.45,21.59 270 top
MOTEUR_ASC_1  41.91,69.85 270 top
MOTEUR_DROIT  41.91,34.29 270 top
MOTEUR_GAUCHE  41.91,105.41 270 top
R1  66.67,25.4 90 top
R2  66.67,83.82 90 top
R3  24.37,86.7 0 top
R4  52.07,83.82 180 top
R5  52.07,116.84 180 top
R6  77.47,43.18 90 top
R7  55.88,50.8 0 top
R8  59.69,36.83 90 top
R9  54.61,17.78 180 top
R10  53.34,60.96 0 top
R11  53.34,91.44 0 top
R12  160.02,88.9 270 top
R13  149.86,72.39 270 top
R14  162.56,113.67 0 top
R15  175.26,69.85 270 top
R20  133.35,46.99 180 top
R21  133.35,44.45 180 top
R22  133.35,41.91 180 top
R23  133.35,39.37 180 top
R24  133.35,36.83 180 top
R25  133.35,34.29 180 top
R26  133.35,31.75 180 top
R27  133.35,29.21 180 top
R28  133.35,26.67 180 top
R29  133.35,24.13 180 top
SERIE  136.19,67.98 90 top
U$1  96.52,73.66 0 top
U$2  137.16,107.95 270 top
US1  136.19,86.36 90 top
US2  144.78,90.17 90 top
US3  136.19,77.17 90 top
US4  136.19,95.55 90 top
USB_RASP  156.21,27.94 0 top

### Tracks (layer width: path | path; a pad name or v marks a point on that pad's centre or on a via)
9V1
  Top 1.016: DC3.VOUT 127,16.51 129.54,13.97 AX-12-EXEMPLE8.VDD | C24.+ 142.24,19.05 142.24,35.56 143.51,36.83 143.51,48.26 144.78,49.53 151.13,49.53 152.4,48.26 160.02,48.26 162.56,50.8 162.56,66.04 163.83,67.31 167.64,67.31 168.91,68.58 C25.+
  Bottom 0.305: R12.1 160.02,99.06 161.29,100.33 163.83,100.33 164.64,100.97 164.67,106.18 163.77,106.68 161.29,106.68 160.02,107.95 161.29,109.22 165.1,109.22 166.37,107.95 166.37,106.68 170.18,102.87 170.18,97.79 171.45,96.52 AX-12-EXEMPLE9.VDD
  Bottom 1.016: AX-12-EXEMPLE9.VDD 171.45,74.93 C25.+ | AX-12-EXEMPLE8.VDD C24.+
9V2
  Top 1.016: C20.+ 166.07,122.59 171.75,122.59 DC4.VOUT
  Bottom 1.016: AX-12-EXEMPLE4.VDD 151.13,121.92 152.2,122.99 159.2,122.99 163.27,122.97 C20.+ 165.1,116.17 163.83,114.9 158.75,114.9 158.12,114.3 R14.1
9V3
  Top 1.016: C2.+ 154.94,102.87 156.28,101.6 163.83,101.6 165.1,100.33 165.1,82.55 166.37,81.28 175.26,81.28 176.53,80.01 176.53,76.2 R15.1
  Bottom 0.305: DC5.VOUT 171.45,72.39 173.99,74.93 R15.1
  Bottom 1.016: AX-12-EXEMPLE1.VDD 149.19,111.16 149.86,110.49 152.4,110.49 153.67,109.22 C2.+
+3V3
  Top 0.305: U$2.LV 133.35,109.22 134.62,110.49 147.32,110.49 148.59,109.22 148.59,96.52 147.32,95.25 143.51,95.25 142.24,93.98 142.24,86.36 140.97,85.09 124.46,85.09 U$1.VDD3
  Bottom 0.305: U$1.VDD2 U$1.VDD3
+5V
  Top 0.305: COD_DROITE.VDD 140.33,61.3 140.97,60.66 140.97,59.02 143.51,57.75 | 143.51,57.75 144.14,57.75 CONTACTEUR2.VDD | US4.VDD 137.46,95.55 138.43,96.52 138.43,106.68 139.7,107.95 140.97,107.95 U$2.HV | 143.51,57.75 142.24,55.88 142.24,53.34 140.97,52.07 113.03,52.07 111.76,50.8 111.76,29.21 111.07,28.52 111.07,13.28 111.49,12.86 111.49,10.42 110.49,8.89 106.68,8.89 105.41,10.16 105.41,15.24 104.14,16.51 DC2.VOUT | US3.VDD 133.99,77.47 133.35,78.11 133.35,80.64 133.99,81.28 156.21,81.28 157.48,82.55 157.48,88.9 156.21,90.17 CONTACTEUR3.VDD
  Bottom 0.305: CONTACTEUR2.VDD 147.95,57.79 151.13,53.34 JUMPER.VDD | R13.1 137.16,77.47 | 137.16,77.47 US3.VDD | COD_GAUCHE.VDD 140.97,118.11 139.7,116.84 139.7,110.49 140.97,109.22 U$2.HV | US4.VDD 119.38,95.55 118.11,94.28 118.11,87.63 119.38,86.36 U$1.5V U$1.5V2 US1.VDD 137.16,86.36 140.97,90.17 US2.VDD CONTACTEUR3.VDD 154.94,90.17 156.61,91.44 156.61,98.99 156.54,99.06 COD_MOTEUR.VDD 157.48,99.06 158.75,97.79 158.75,92.71 160.02,91.44 164.73,91.44 165.3,91.91 165.3,107.48 163.83,107.95 CONTACTEUR1.VDD | COD_DROITE.VDD 138.43,63.5 138.43,68.58 137.76,69.25 129.54,69.25 127,67.31 122.55,67.31 121.92,67.95 121.92,69.22 122.55,69.85 124.46,69.85 125.73,71.12 125.73,72.09 126.93,73.29 127.33,73.36 137.46,73.36 138.73,74.33 138.73,76.2 137.16,77.47
+5V_RASP
  Top 1.016: R9.1 62.23,17.78 63.5,19.05 63.5,21.59 64.77,22.86 67.31,22.86 68.58,21.59 68.58,19.05 69.85,17.78 80.01,17.78 DC1.VOUT 82.55,16.51 83.82,15.24 83.82,7.62 85.09,6.35 144.78,6.35 146.05,7.62 146.05,20.32 152.7,23.83 USB_RASP.VIN
+12V_LIPO
  Top 0.406: BORNIER-LIPO-B.1 19.08,10.14 21.59,7.62 71.12,7.62 72.39,8.89 72.39,15.24 71.12,16.51 67.31,16.51 66.67,17.15 R1.1
  Bottom 3.81: BORNIER-LIPO-B.1 BORNIER-LIPO-A.2
+24V
  Top 1.93: 86.36,24.13 85.09,25.4 63.5,25.4 62.23,26.67 62.23,33.02 59.69,35.56 53.06,35.56 51.82,34.32 51.82,32.01 C10.+ | 86.36,24.13 86.36,19.09 L2.1 86.4,11.47 18.+ | 86.36,24.13 87.63,25.4 107.95,25.4 109.22,24.13 20.+ 107.95,22.86 106.95,21.59 106.95,13.97 107.95,12.7 L3.1
  Bottom 0.305: 175.26,35.56 173.99,35.56 | 109.22,12.66 L3.1
  Bottom 1.93: MOTEUR_GAUCHE.6 48.26,105.41 49.53,106.68 49.53,108.46 C7.+ 50.29,105.92 50.8,105.41 53.34,105.41 54.61,104.14 54.61,101.09 C8.+ 53.34,100.33 52.07,99.06 52.07,92.71 50.8,91.44 50.8,78.74 49.02,76.96 C15.+ 49.02,70.36 50.8,68.58 C16.+ | 2.+ 175.89,100.97 175.26,100.33 L4.1 173.99,99.06 180.34,96.52 180.34,38.1 175.26,35.56 | 109.22,12.66 109.22,8.89 111.76,6.35 173.99,6.35 176.53,8.89 176.53,34.29 173.99,35.56 L5.1 173.31,42.58 172.72,43.18 4.+
  Bottom 3.81: 34.29,13.92 35.56,15.24 36.83,16.51 43.18,21.59 43.18,33.02 41.91,34.29 MOTEUR_DROIT.6 40.64,34.29 43.18,36.83 43.18,43.18 44.45,44.45 C9.+ | 34.29,12.7 34.29,13.92 | 34.29,13.92 ARRET-LIPOS.2 | C9.+ 50.29,38.61 51.47,37.13 C10.+ | C9.+ 45.72,44.45 43.18,46.99 43.18,68.58 41.91,69.85 | 41.91,69.85 MOTEUR_ASC_1.6 | 41.91,69.85 44.45,72.39 44.45,74.93 45.72,76.2 C15.+
+24V_LIPO
  Top 0.305: R3.1 17.98,86.56 16.51,85.09 16.51,52.07 15.24,50.8 3.81,50.8
  Top 0.406: GROS_CONDO.+ 19.05,27.94 15.88,26.04 3.18,26.04 2.54,26.67 2.54,49.53 3.81,50.8
  Top 3.81: ARRET-RASP.2 44.45,12.75 44.45,15.24 41.91,17.78 27.94,17.78 24.08,13.92 BORNIER-LIPO-B.2
  Bottom 3.81: GROS_CONDO.+ 19.05,21.59 24.06,16.88 24.13,12.75 BORNIER-LIPO-B.2 ARRET-LIPOS.1
+24V_RASP
  Bottom 1.93: C12.+ 62.27,19.01 L1.1 62.23,12.66 62.23,10.16 60.96,7.62 41.91,7.62 39.37,10.16 39.37,12.67 ARRET-RASP.1
B
  Top 0.305: AX-12-EXEMPLE9.DATA 173.99,77.47 172.72,76.2 172.72,74.93 | 172.72,74.93 172.72,64.77 173.99,63.5 173.99,39.37 172.72,38.1 163.83,38.1 161.29,35.56 144.78,35.56 143.51,34.29 143.51,8.89 142.24,7.62 132.08,7.62 130.81,8.89 AX-12-EXEMPLE8.DATA | AX-12-EXEMPLE1.DATA 153,114.3 153.69,113.7 153.67,100.33 153.67,97.79 154.94,96.52 161.29,96.52 162.56,95.25 162.56,77.47 163.83,76.2 171.45,76.2 172.72,74.93
  Bottom 0.305: AX-12-EXEMPLE1.DATA 151.87,114.44 151.87,116.78 150.54,118.11 149.86,118.11 148.66,119.31 AX-12-EXEMPLE4.DATA 148.66,119.45 147.32,118.11 143.3,118.11 142.27,117.08 142.27,114.33 U$2.TXO-1
BUZZER
  Bottom 0.305: U$1.PE1 125.73,68.58 127,69.85 127,71.12 128.31,72.39 162.56,72.39 163.83,71.12 163.83,46.99 162.56,44.45 JP1.2
COD_ASCENSEUR_A
  Bottom 0.305: COD_MOTEUR.A 152.4,97.79 155.85,94.61 155.88,92.08 154.94,91.44 141.27,91.44 137.46,87.63 119.38,87.63 118.74,88.27 118.74,93.35 119.38,94.28 137.8,94.28 138.43,94.92 138.43,95.89 138.11,96.2 | 81.28,57.15 71.12,57.15 U$1.PE9
  Bottom 0.406: 81.28,57.15 113.03,57.15 115.57,59.69 115.57,74.93 119.38,78.74 119.38,85.09 116.84,87.63 116.84,95.55 118.11,96.82 137.5,96.82 138.11,96.2
COD_ASCENSEUR_B
  Top 0.305: U$1.PE11 71.12,54.61 73.66,54.61 76.2,52.07 76.2,46.99 77.47,45.72 80.01,45.72 82.55,48.26 82.55,92.71 84.12,94.28 138.43,94.28 139.7,95.25 139.7,97.79 140.97,99.06 COD_MOTEUR.B
COD_DROIT_A
  Bottom 0.305: COD_DROITE.A 133.99,58.76 133.35,58.42 U$1.PB5
COD_DROIT_B
  Top 0.305: COD_DROITE.B 126.67,53.67 125.73,54.31 125.73,55.88 124.46,57.15 121.92,57.15 U$1.PB4
COD_GAUCHE_A
  Bottom 0.406: U$1.PA0 110.49,76.2 112.39,78.74 112.39,120.65 113.67,121.92 130.81,121.92 132.08,123.19 137.16,123.19 138.43,121.92 COD_GAUCHE.A
COD_GAUCHE_B
  Bottom 0.305: U$1.PA1 71.12,74.93 111.76,74.93 113.67,77.47 113.67,119.38 114.93,120.65 COD_GAUCHE.B
CONTACTEUR1
  Top 0.305: U$1.PB12 74.93,45.72 76.2,44.45 81.28,44.45 83.82,46.99 83.82,91.44 85.39,93.01 US4.DATA
CONTACTEUR2
  Top 0.305: CONTACTEUR2.DATA 144.14,55.24 143.51,54.61 143.51,52.07 142.24,50.8 127,50.8 125.73,49.53 125.73,48.26 124.46,46.99 121.92,46.99 U$1.PC12
CONTACTEUR3
  Top 0.305: U$1.PD11 71.12,34.29 71.12,29.84 71.75,29.21 109.22,29.21 110.49,30.48 110.49,80.01 113.03,82.55 154.94,82.55 156.21,83.82 156.21,86.36 154.94,87.63 CONTACTEUR3.DATA
GND
  Top 0.305: 58.42,99.82 C8.- | SERIE.GND 137.16,72.39 151.13,72.39 152.4,73.66 152.4,77.47 154.94,80.01 | 154.94,80.01 157.48,80.01 158.75,81.28 158.75,90.17 156.21,92.71 CONTACTEUR3.GND | 154.94,80.01 US3.GND | CONTACTEUR1.GND 162.56,115.57 161.29,116.84
  Top 0.406: R2.2 U$1.GND U$1.GND1
  Top 1.016: 38.51,73.66 MOTEUR_ASC_1.4 | 53.34,44.45 C9.- | AX-12-EXEMPLE4.GND 153.67,118.11 | 153.67,118.11 154.94,116.84 161.29,116.84 166.37,116.84 167.64,118.11 C20.- 168.91,119.38 173.99,119.38 175.26,120.65 | LED3.K 165.1,71.12 C25.- | AX-12-EXEMPLE1.GND 146.65,116.17 147.32,116.84 152.4,116.84 153.67,118.11 | DC4.GND 175.26,120.65 | 175.26,120.65 175.26,119.38 180.34,114.3 180.34,85.09 179.07,83.82 LED4.K
  Top 1.93: 38.51,73.66 41.91,73.66 43.18,74.93 43.18,82.55 44.45,83.82 R4.2 46.99,81.28 48.26,80.01 50.8,80.01 52.07,78.74 52.07,76.71 C15.- | R11.1 48.26,95.25 49.53,96.52 57.15,96.52 58.42,97.79 58.42,99.82 | MOTEUR_DROIT.4 50.39,37.69 52.07,39.37 52.07,43.18 53.34,44.45
  Top 3.81: GROS_CONDO.- 8.89,36.83 11.43,39.37 19.05,39.37 | 19.05,39.37 21.59,41.91 D1.A 22.86,46.99 22.86,65.67 23.5,65.41 | MOTEUR_DROIT.7 25.83,32.59 19.05,39.37 | MOTEUR_ASC_1.7 26.24,68.15 23.5,65.41 | 22.93,86.36 22.93,90.24 25.4,92.71 41.91,92.71 44.45,95.25 44.45,106.68 42.32,108.81 MOTEUR_GAUCHE.4 | 22.93,86.36 22.93,67.31 22.86,66.04 23.5,65.41 | MOTEUR_GAUCHE.7 19.89,103.71 17.78,101.6 17.78,91.44 19.05,90.17 20.32,90.17 22.86,87.63 22.86,86.43 22.93,86.36
  Bottom 0.305: U$1.GND9 U$1.GND8 | U$1.GND6 U$1.GND7 US1.GND 137.16,88.9 140.97,92.71 | 140.33,60.33 139.7,59.69 139.7,57.82 139.03,57.15 137.09,57.15 COD_DROITE.GND | 140.97,92.71 US2.GND CONTACTEUR3.GND 153.67,95.25 152.4,96.52 151.13,96.52 149.86,97.79 COD_MOTEUR.GND 149.86,101.6 152.33,102.57 C2.- U$2.GND-1 | 140.97,92.71 139.7,93.98 139.7,96.52 138.43,97.79 US4.GND 135.89,105.41 134.62,106.68 | R2.2 66.67,99.06 65.41,100.33 C8.- | 53.34,110.49 53.34,109.73 | R6.1 77.47,29.21 76.2,27.94 U$1.GND5 | COD_GAUCHE.GND 135.89,107.95 134.62,106.68 | U$2.GND-2 134.62,106.68 | SERIE.GND 138.43,70.52 | IC1.11 146.05,22.86 | CONTACTEUR1.GND 167.64,110.49 1.- 168.27,107.32 168.91,106.68 2.- | 168.91,80.01 AX-12-EXEMPLE9.GND
  Bottom 0.813: LED1.K 54.61,21.59 55.88,22.86 C12.-
  Bottom 1.016: IC1.18 IC1.19 IC1.20 157.48,46.99 158.75,48.26 158.75,54.61 JUMPER.GND | IC1.18 IC1.17 IC1.16 IC1.15 IC1.14 IC1.13 IC1.12 IC1.11 146.05,20.32 144.78,19.05 138.43,19.05 137.16,17.78 C24.- | JUMPER.GND 151.13,55.88 147.95,60.33 CONTACTEUR2.GND 140.33,60.33 139.7,60.96 139.7,69.25 138.43,70.52 | JUMPER.GND 156.21,58.42 LED2.K | DC1.GND 82.55,13.97 83.82,12.7 83.82,10.16 85.09,8.89 18.- C17.- 97.79,8.89 99.06,10.16 99.06,12.7 100.33,13.97 DC2.GND 105.41,13.97 106.68,15.24 106.68,19.05 107.95,20.32 20.- 19.- 120.65,20.32 | C25.- 166.37,77.47 167.64,78.74 AX-12-EXEMPLE9.GND LED4.K | C24.- AX-12-EXEMPLE8.GND 128.27,16.51 125.73,13.97 DC3.GND 121.92,13.97 120.65,15.24 120.65,20.32 | C24.- 159.67,16.51 | 159.67,16.51 170.18,16.51 171.45,17.78 LED5.K | SERIE.GND 158.15,70.52 LED3.K | USB_RASP.GND 159.67,30.48 159.67,16.51 | U$1.GND8 120.65,20.32 | 3.- 165.1,49.53 165.1,43.18 163.83,41.91 JP1.1 IC1.18
  Bottom 1.93: C11.- C12.- 60.96,30.48 R8.1 C10.- 55.12,40.13 53.85,41.4 C9.- 53.74,45.36 53.34,49.53 52.07,50.8 R7.1 49.53,50.8 48.26,52.07 R10.1 48.26,64.77 49.53,66.04 58.42,66.04 58.93,66.55 C16.- 58.42,69.09 58.42,69.85 57.15,71.12 53.34,71.12 52.58,71.88 C15.- | U$1.GND4 U$1.GND5 72.39,24.13 C11.- | C11.- 73.66,21.59 73.66,15.24 74.93,13.97 DC1.GND | C7.- 57.15,109.22 58.42,107.95 58.42,100.84 C8.- | C7.- 55.88,109.22 57.15,110.49 R5.1 | R4.2 46.99,90.17 R11.1 | MOTEUR_GAUCHE.4 46.58,108.81 49.53,111.76 52.07,111.76 53.34,110.49 | 53.34,109.73 C7.- | 4.- 170.18,50.8 168.91,52.07 3.- 167.64,59.69 168.91,60.96 DC5.GND
  pour Top: -2.54,129.54 187.96,129.54 187.96,-5.08 -2.54,-5.08
  pour Bottom: -7.62,133.35 193.04,133.35 193.04,-7.62 -7.62,-7.62
JUMPER
  Top 0.305: U$1.PC10 121.92,44.45 124.46,44.45 127,46.99 127,48.26 128.27,49.53 142.24,49.53 143.51,50.8 JUMPER.DATA
LED1
  Bottom 0.305: R26.2 129.54,31.75 127,34.29 119.38,34.29 118.11,35.56 118.11,67.31 U$1.PE0
LED2
  Bottom 0.305: U$1.PA15 129.54,34.29 R25.2
LED3
  Bottom 0.305: U$1.PC7 129.54,24.13 R29.2
LED4
  Bottom 0.305: U$1.PC8 121.92,31.75 124.46,31.75 129.54,26.67 R28.2
LED5
  Bottom 0.305: U$1.PC9 125.73,33.02 129.54,29.21 R27.2
LED6
  Bottom 0.305: U$1.PC11 129.54,36.83 R24.2
LED7
  Bottom 0.305: U$1.PD0 129.54,39.37 R23.2
LED8
  Bottom 0.305: U$1.PD2 129.54,41.91 R22.2
LED9
  Bottom 0.305: U$1.PD4 129.54,44.45 R21.2
LED10
  Bottom 0.305: U$1.PD6 129.54,46.99 R20.2
MOTEUR_ASCENSEUR_DIR
  Top 0.305: MOTEUR_ASC_1.3 33.02,74.93 37.03,71.42 45.72,71.42 46.99,69.85 46.99,64.77 48.26,63.5 57.15,63.5 58.42,62.23 R10.2
  Bottom 0.305: R10.2 66.04,60.96 67.31,59.69 67.31,52.07 68.58,50.8 U$1.PE13
MOTEUR_ASCENSEUR_PWM
  Top 0.305: MOTEUR_ASC_1.5 32.59,71.12 27.94,71.12 26.67,72.39 26.67,80.01 27.94,81.28 33.02,81.28 34.29,82.55 34.29,85.09 35.56,86.36 53.34,86.36 54.61,85.09 54.61,82.55 55.88,81.28 58.42,81.28 59.69,82.55 59.69,90.17 R11.2 63.5,91.44 64.77,90.17 64.77,29.21 66.04,27.94 67.31,27.94 68.58,29.21 68.58,39.37 U$1.PB15
MOTEUR_DROIT_DIR
  Top 0.305: MOTEUR_DROIT.3 29.19,39.39 27.94,40.64 27.94,52.07 29.21,53.34 59.69,53.34 60.96,52.07 R7.2
  Bottom 0.305: R7.2 66.04,50.8 67.31,49.53 67.31,38.1 68.58,36.83 71.12,36.83 U$1.PD12
MOTEUR_DROIT_PWM
  Top 0.305: MOTEUR_DROIT.5 51.23,35.99 54.61,39.37 54.61,40.64 55.88,41.91 R8.2
  Bottom 0.305: U$1.PB11 68.58,46.99 68.58,49.53 66.04,52.07 59.69,52.07 58.42,50.8 58.42,45.72 59.69,44.45 R8.2
MOTEUR_GAUCHE_DIR
  Top 0.305: U$1.PD14 73.66,33.02 74.93,34.29 74.93,43.18 73.66,44.45 69.22,44.45 68.58,45.08 68.58,56.52 69.22,57.15 77.47,57.15 78.74,58.42 78.74,119.38 77.47,120.65 31.75,120.65 30.48,119.38 30.48,113.03 33,110.51 MOTEUR_GAUCHE.3 33.04,110.49 34.29,110.49 35.56,111.76 35.56,115.57 36.83,116.84 R5.2
MOTEUR_GAUCHE_PWM
  Top 0.305: MOTEUR_GAUCHE.5 26.24,107.11 25.4,107.95 25.4,120.65 26.67,121.92 80.01,121.92 81.28,120.65 81.28,49.53 80.01,48.26 R6.2
  Bottom 0.305: U$1.PB10 R6.2
N$1
  Bottom 3.81: BORNIER-LIPO-A.1 6.35,12.7 3.81,15.24 3.81,43.18 D1.C
N$2
  Bottom 3.81: C4.1 29.21,97.79 30.48,96.52 32.63,96.52 MOTEUR_GAUCHE.11
N$3
  Bottom 3.81: C3.1 32.63,114.3 MOTEUR_GAUCHE.1
N$4
  Bottom 3.81: C13.1 32.63,78.44 MOTEUR_ASC_1.1
N$5
  Bottom 3.81: C14.1 33.02,60.96 MOTEUR_ASC_1.11
N$6
  Bottom 3.81: BORNIER_MOTEUR_ASCENSEUR.1 20.34,90.14 27.27,83.52 C13.2 36.83,83.52 38.1,81.65 MOTEUR_ASC_1.2
N$7
  Bottom 3.81: BORNIER_MOTEUR_ASCENSEUR.2 16.46,85.14 24.13,77.47 24.13,57.15 25.4,55.88 C14.2 36.83,55.88 38.1,57.15 MOTEUR_ASC_1.10
N$8
  Top 1.93: L4.2 167.75,104.16 170.81,106.91 1.+
  Bottom 1.93: DC4.VIN 177.8,114.3 1.+
N$9
  Bottom 0.813: R9.2 49.53,15.24 LED1.A
N$10
  Bottom 3.81: C5.1 32.63,43.18 MOTEUR_DROIT.1
N$11
  Bottom 3.81: C6.1 30.09,26.67 MOTEUR_DROIT.11
N$12
  Bottom 1.93: DC1.VIN 68.58,11.43 67.31,12.7 L1.2 67.27,17.74 C11.+
N$15
  Top 1.93: C17.+ DC2.VIN
  Bottom 1.93: L2.2 91.4,12.74 C17.+
N$18
  Bottom 3.81: BORNIER_MOTEUR_GAUCHE.1 10.16,119.38 11.43,120.65 26.67,120.65 C3.2 36.83,119.38 38.1,118.11 MOTEUR_GAUCHE.2
N$19
  Bottom 3.81: BORNIER_MOTEUR_GAUCHE.2 10.16,96.52 11.43,95.25 21.59,95.25 24.13,97.79 C4.2 24.13,92.71 25.4,91.44 36.83,91.44 38.1,92.71 MOTEUR_GAUCHE.10
N$20
  Bottom 3.81: BORNIER_MOTEUR_DROIT.1 11.45,64.74 15.24,60.96 16.51,58.42 25.4,49.53 29.21,49.53 C5.2 36.83,48.26 38.1,46.99 MOTEUR_DROIT.2
N$21
  Bottom 3.81: BORNIER_MOTEUR_DROIT.2 10.16,57.15 15.24,52.07 15.24,41.91 25.4,33.02 25.4,24.13 27.57,21.59 C6.2 35.19,21.59 36.53,23.16 38.1,25.4 MOTEUR_DROIT.10
N$22
  Top 1.93: 19.+ 114.3,22.86 113.03,21.59 113.03,13.93 L3.2
  Bottom 0.305: L3.2 114.3,12.7
  Bottom 1.93: 114.3,12.7 115.57,11.43 DC3.VIN
N$24
  Top 1.93: 3.+ 170.18,49.53 171.45,50.8 DC5.VIN
  Bottom 0.305: 3.+ 167.64,36.23 L5.2
N$26
  Bottom 0.305: R20.1 IC1.1
N$27
  Bottom 0.305: R21.1 IC1.2
N$28
  Bottom 0.305: R22.1 IC1.3
N$29
  Bottom 0.305: R23.1 IC1.4
N$30
  Bottom 0.305: R24.1 IC1.5
N$31
  Bottom 0.305: R25.1 IC1.6
N$32
  Bottom 0.305: R26.1 IC1.7
N$33
  Bottom 0.305: R27.1 IC1.8
N$34
  Bottom 0.305: R28.1 IC1.9
N$35
  Bottom 0.305: R29.1 IC1.10
N$36
  Bottom 0.305: R13.2 149.86,66.04 151.13,64.77 156.21,64.77 157.48,63.5 LED2.A
N$38
  Bottom 0.305: R12.2 160.02,74.93 LED3.A
N$40
  Top 1.016: R15.2 175.26,27.94 173.99,26.67 172.72,26.67 171.45,25.4 LED5.A
N$42
  Top 0.305: R14.2 167,113.67 166.07,113.03 166.07,91.44 168.91,88.9 LED4.A
TEST_LIPO_12V
  Top 0.406: R1.2 R2.1 67.31,80.01 U$1.PC1
TEST_LIPO_24V
  Top 0.406: R3.2 29.55,87.93 30.92,88.9 50.8,88.9 | 50.8,88.9 55.88,88.9 57.15,87.56 R4.1 | U$1.PC2 74.93,78.74 76.2,80.01 76.2,90.17 72.39,93.98 54.61,93.98 53.34,92.71 53.34,91.44 50.8,88.9
UART-3V-AX12
  Bottom 0.305: U$1.PA3 U$1.PA2 113.03,73.66 114.93,76.2 114.93,113.03 116.2,114.3 U$2.TXI-1
UART_JAUNE
  Bottom 0.305: SERIE.DATA 135.52,64.77 132.08,64.77 130.81,63.5 130.81,60.96 129.54,59.69 121.92,59.69 U$1.PB6
UART_ROUGE
  Bottom 0.305: SERIE.VDD 132.08,67.98 129.54,66.04 129.54,62.23 128.27,60.96 U$1.PB7
US1
  Bottom 0.305: U$1.PC15 129.54,78.74 130.81,80.01 130.81,82.55 132.08,83.82 US1.DATA
US2
  Bottom 0.305: US2.DATA 144.78,83.82 142.88,81.92 133.35,81.92 132.08,80.64 132.08,78.74 130.81,77.47 | 83.82,43.18 U$1.PB14
  Bottom 0.406: 83.82,43.18 115.57,43.18 116.84,44.45 116.84,74.93 119.38,77.47 130.81,77.47
US3
  Bottom 0.305: US3.DATA 125.73,74.63 124.46,76.2 U$1.PC13
US4
  Bottom 0.305: 121.92,123.92 166.02,123.98 166.37,123.7 166.37,114.3 165.1,113.03 160.02,113.03 158.75,111.76 158.75,106.68 160.02,105.41 CONTACTEUR1.DATA
  Bottom 0.406: 121.92,123.92 111.11,123.92 110.49,123.2 110.49,81.28 109.22,80.01 73.66,80.01 U$1.PC0

### Text on the board
Document: CODG | 9V2 | 9V3 | GCHE | PELLE | 9V2 | R N | PELLE | MOTEUR GAUCHE | DTE | USAVG | MOTEUR | CODA | ASCENSEUR | CONT1 | R N | USAVD | CONT3 | 9V2 | USARG | 9V1 | USARD | GAUCHES | MOTEUR | 9V1 | DROIT | 5V | SERIE | ATTRAPE ET CALE-MODULES | N V | 9V3 | CONT2 | CODD | JUMPER | BUZZER | 9V3 | 9V1 | 5V-RASP | 9V1 | 5V-RASP | 5V | ATTRAPE ET CALE-MODULES | LIPO-A | LIPO-B | ARRET | ARRET | DROITS | - + | - + | LIPOS | RASP
Reference: TOIT | ARRIERE | AVANT